# Altium schematic sheet Sensor.SchDoc
size A3
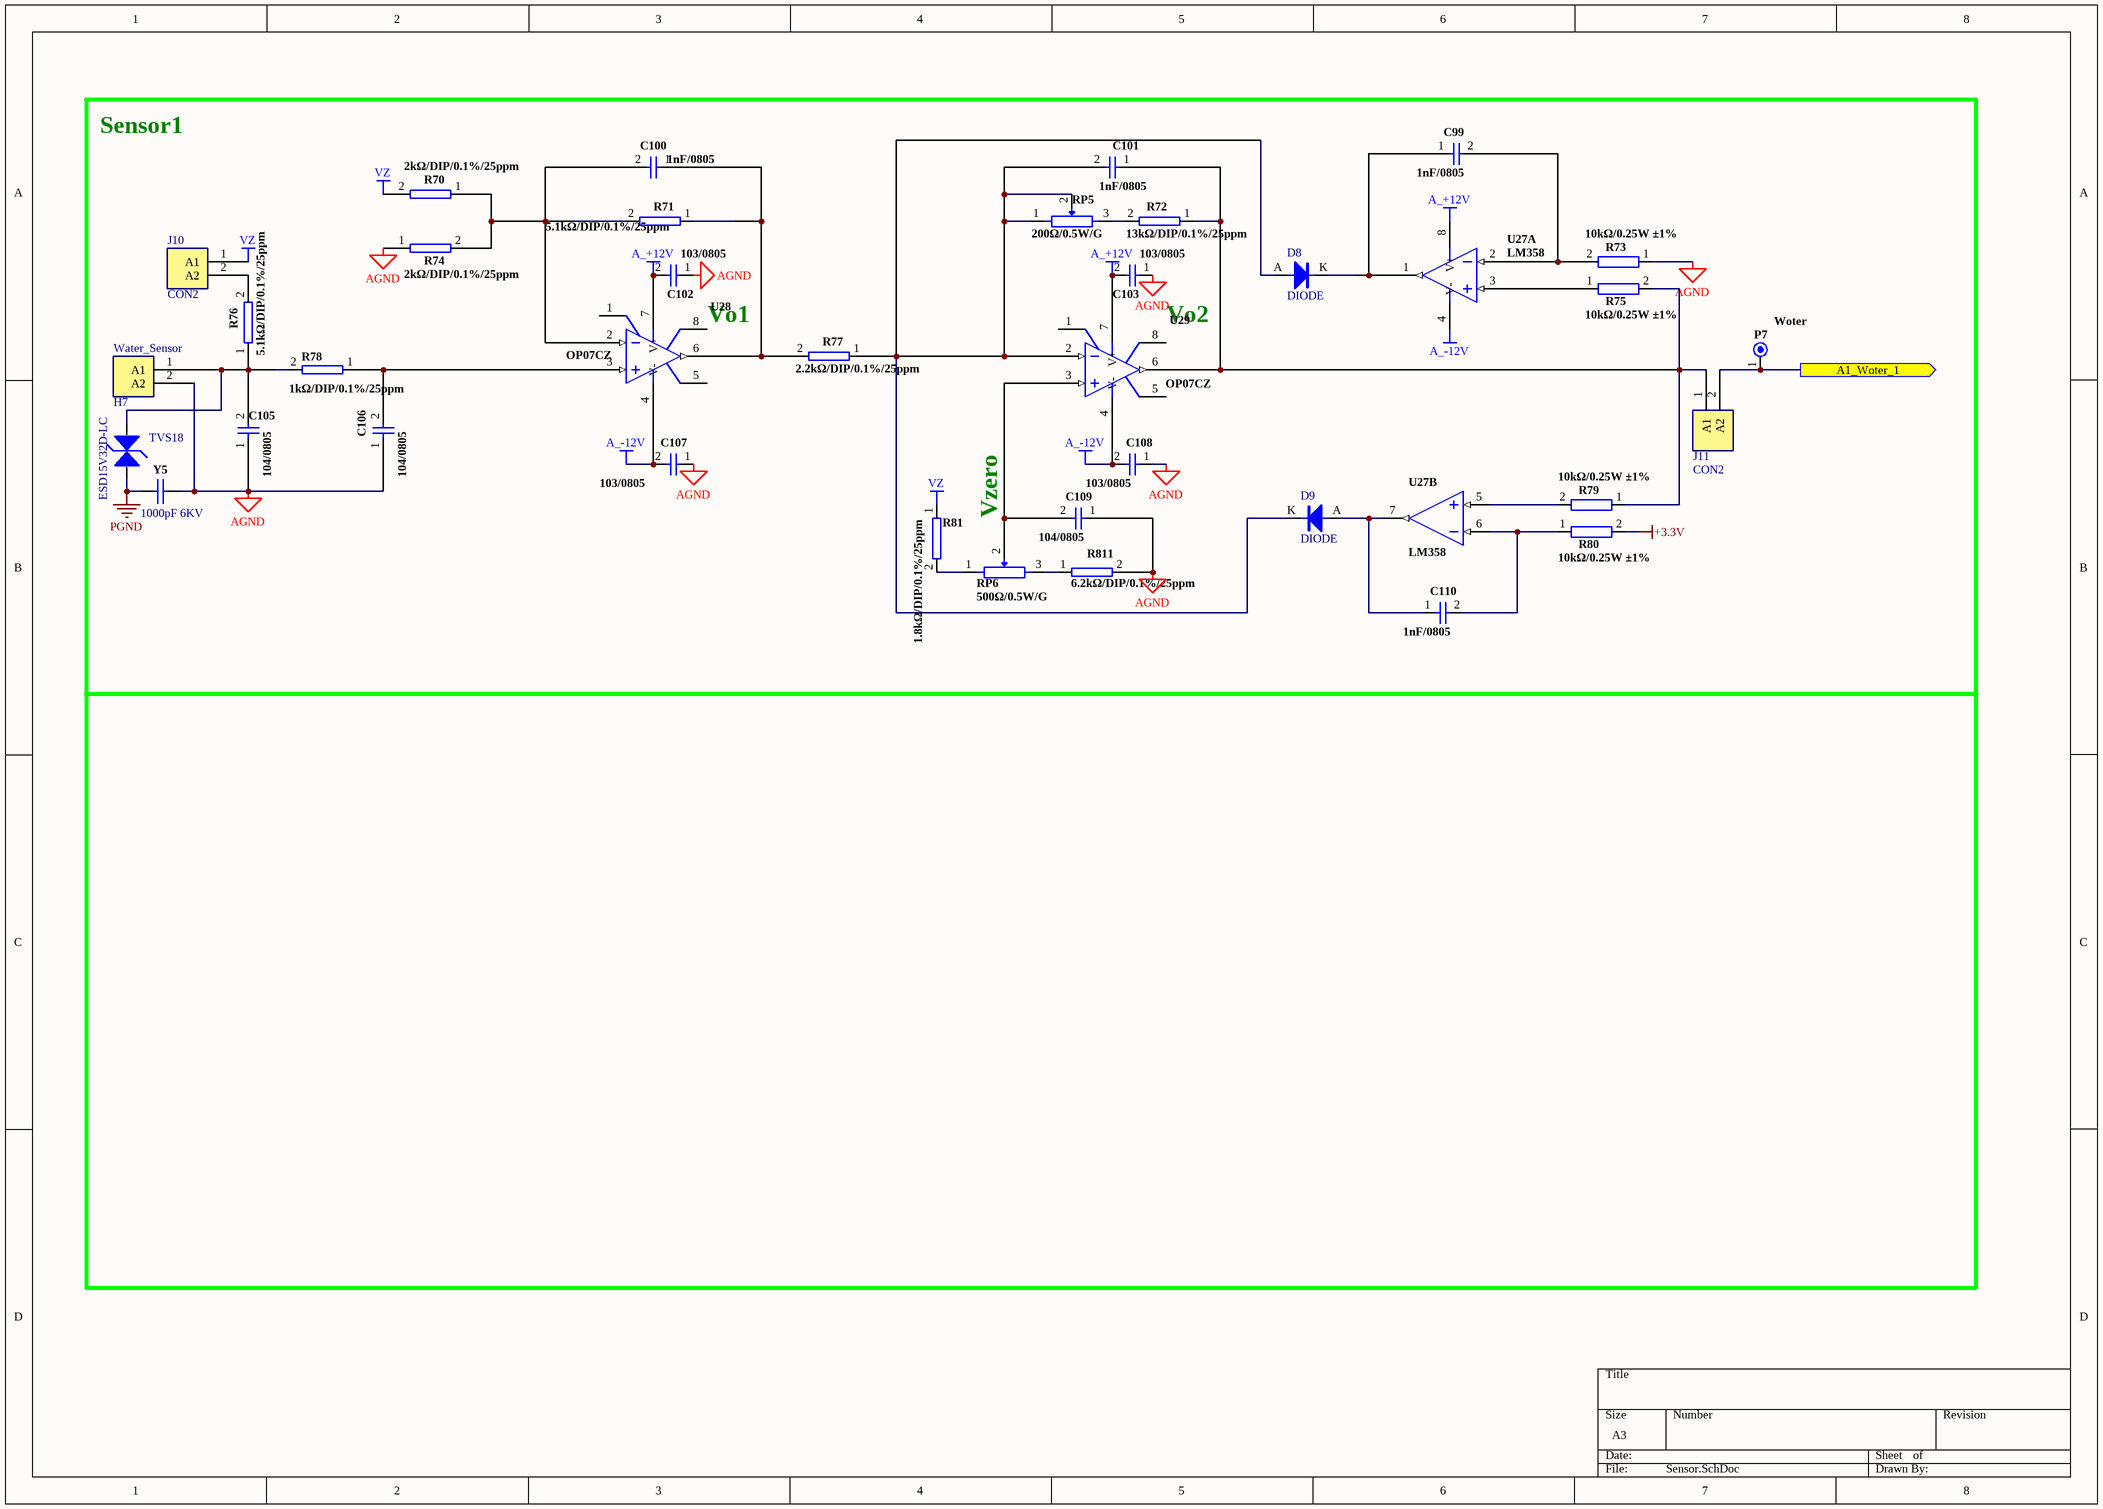
[diagram p0: Sensor.SchDoc]

## Parts
C99  1nF/0805  [C0805]
C100  1nF/0805  [C0805]
C101  1nF/0805  [C0805]
C102  103/0805  [C0805]
C103  103/0805  [C0805]
C105  104/0805  [C0805]
C106  104/0805  [C0805]
C107  103/0805  [C0805]
C108  103/0805  [C0805]
C109  104/0805  [C0805]
C110  1nF/0805  [C0805]
D8  DIODE  [SOD123]
D9  DIODE  [SOD123]
H7  Water_Sensor  [XH2]
J10  CON2  [2Pin-2.54]
J11  CON2  [2Pin-2.54]
P7  Woter  [TESTSMD]
R70  2kΩ/DIP/0.1%/25ppm  [AXIAL0.4]
R71  5.1kΩ/DIP/0.1%/25ppm  [AXIAL0.4]
R72  13kΩ/DIP/0.1%/25ppm  [AXIAL0.4]
R73  10kΩ/0.25W ±1%  [R0805]
R74  2kΩ/DIP/0.1%/25ppm  [AXIAL0.4]
R75  10kΩ/0.25W ±1%  [R0805]
R76  5.1kΩ/DIP/0.1%/25ppm  [AXIAL0.4]
R77  2.2kΩ/DIP/0.1%/25ppm  [AXIAL0.4]
R78  1kΩ/DIP/0.1%/25ppm  [AXIAL0.4]
R79  10kΩ/0.25W ±1%  [R0805]
R80  10kΩ/0.25W ±1%  [R0805]
R81  1.8kΩ/DIP/0.1%/25ppm  [AXIAL0.4]
R811  6.2kΩ/DIP/0.1%/25ppm  [AXIAL0.4]
RP5  200Ω/0.5W/G  [3224W]
RP6  500Ω/0.5W/G  [3224W]
TVS18  ESD15V32D-LC  [SOD323]
U27  LM358  [SO-8]  (parts A,B of 2)
U28  OP07CZ  [SO-8]
U29  OP07CZ  [SO-8]
Y5  1000pF 6KV  [CY1002]

## Ports
A1_Woter_1 (out)

## Nets
+3.3V: R80.2
A_+12V: C102.2 C103.2 U27.8(V+) U28.7(V+) U29.7(V+)
A_-12V: C107.2 C108.2 U27.4(V-) U28.4(V-) U29.4(V-)
AGND: C102.1 C103.1 C105.1 C106.1 C107.1 C108.1 C109.1 H7.2(A2) R73.1 R74.1 R811.2 Y5.2
PGND: TVS18.2 Y5.1
VZ: J10.1(A1) R70.2 R81.1
A1_Woter_1: J11.2(A2) P7.1 ; port A1_Woter_1
NetC99_1: C99.1 D8.K U27.1
NetC99_2: C99.2 R73.2 U27.2
NetC100_1: C100.1 R71.1 R77.2 U28.6
NetC100_2: C100.2 R70.1 R71.2 R74.2 U28.2
NetC101_1: C101.1 J11.1(A1) R72.1 R75.2 R79.1 U29.6
NetC101_2: C101.2 D8.A D9.K R77.1 RP5.1 RP5.2 U29.2
NetC105_2: C105.2 H7.1(A1) R76.1 R78.2 TVS18.1
NetC106_2: C106.2 R78.1 U28.3
NetC109_2: C109.2 RP6.2 U29.3
NetC110_1: C110.1 D9.A U27.7
NetC110_2: C110.2 R80.1 U27.6
NetJ10_2: J10.2(A2) R76.2
NetR72_2: R72.2 RP5.3
NetR75_1: R75.1 U27.3
NetR79_2: R79.2 U27.5
NetR81_2: R81.2 RP6.1
NetR811_1: R811.1 RP6.3

Not connected (* = marked no-connect by the designer): U28 1 5 8; U29 1 5 8

## Notes on the sheet
- Sensor1
- Vo1
- Vo2
- Vzero

## Library data of the parts
C99-C101 C110 = CAP: 贴片电容 1nF/25V ±1% C0805
C102 C103 C107 C108 = CAP: 贴片电容 103/25V ±1% C0805
C105 C106 C109 = CAP: 贴片电容 104/25V ±1% C0805
D8 D9 = DIODE: 高速开关二极管 IN4148 1V 150mA SOD123
H7 = CON2: 插座式端子 XH2.54-2P 250V(DC/AC) 3A
J10 J11 = CON2: 单排排针（2针）2.54mm 2Pin-2.54
P7 = CON1: 测试点
R70 R74 = RES2: 高精度电阻 2kΩ DIP 0.25W ±0.1% 25ppm AXIAL0.4
R71 R76 = RES2: 高精度电阻 5.1kΩ DIP 0.25W ±0.1% 25ppm AXIAL0.4
R72 = RES2: 高精度电阻 13kΩ DIP 0.25W ±0.1% 25ppm AXIAL0.4
R73 R75 R79 R80 = RES2: 贴片电阻 10kΩ 0.25W ±1% R0805
R77 = RES2: 高精度电阻 2.2kΩ DIP 0.25W ±0.1% 25ppm AXIAL0.4
R78 = RES2: 高精度电阻 1kΩ DIP 0.25W ±0.1% 25ppm AXIAL0.4
R81 = RES2: 高精度电阻 1.8kΩ 0.25W ±0.1% 25ppm AXIAL0.4
R811 = RES2: 高精度电阻 6.2kΩ DIP 0.25W ±0.1% 25ppm AXIAL0.4
RP5 = RPOT: 高精密可调电位器 200Ω/0.5W/G 3224W
RP6 = RPOT: 高精密可调电位器 500Ω/0.5W/G 3224W
TVS18 = TVS: ESD静电二极管 ESD15V32D-LC 15V 15KV 40A SOD323
U27 = MC1458D: 双运算放大器 LM358 SO-8
U28 U29 = OP07CZ: 运算放大器 OP07CZ SO-8
Y5 = CAP: 安规电容 1000pF 6KV ±20% CY1002; C: 1000PF/安规Y; 物: *; 部: *; 供: *